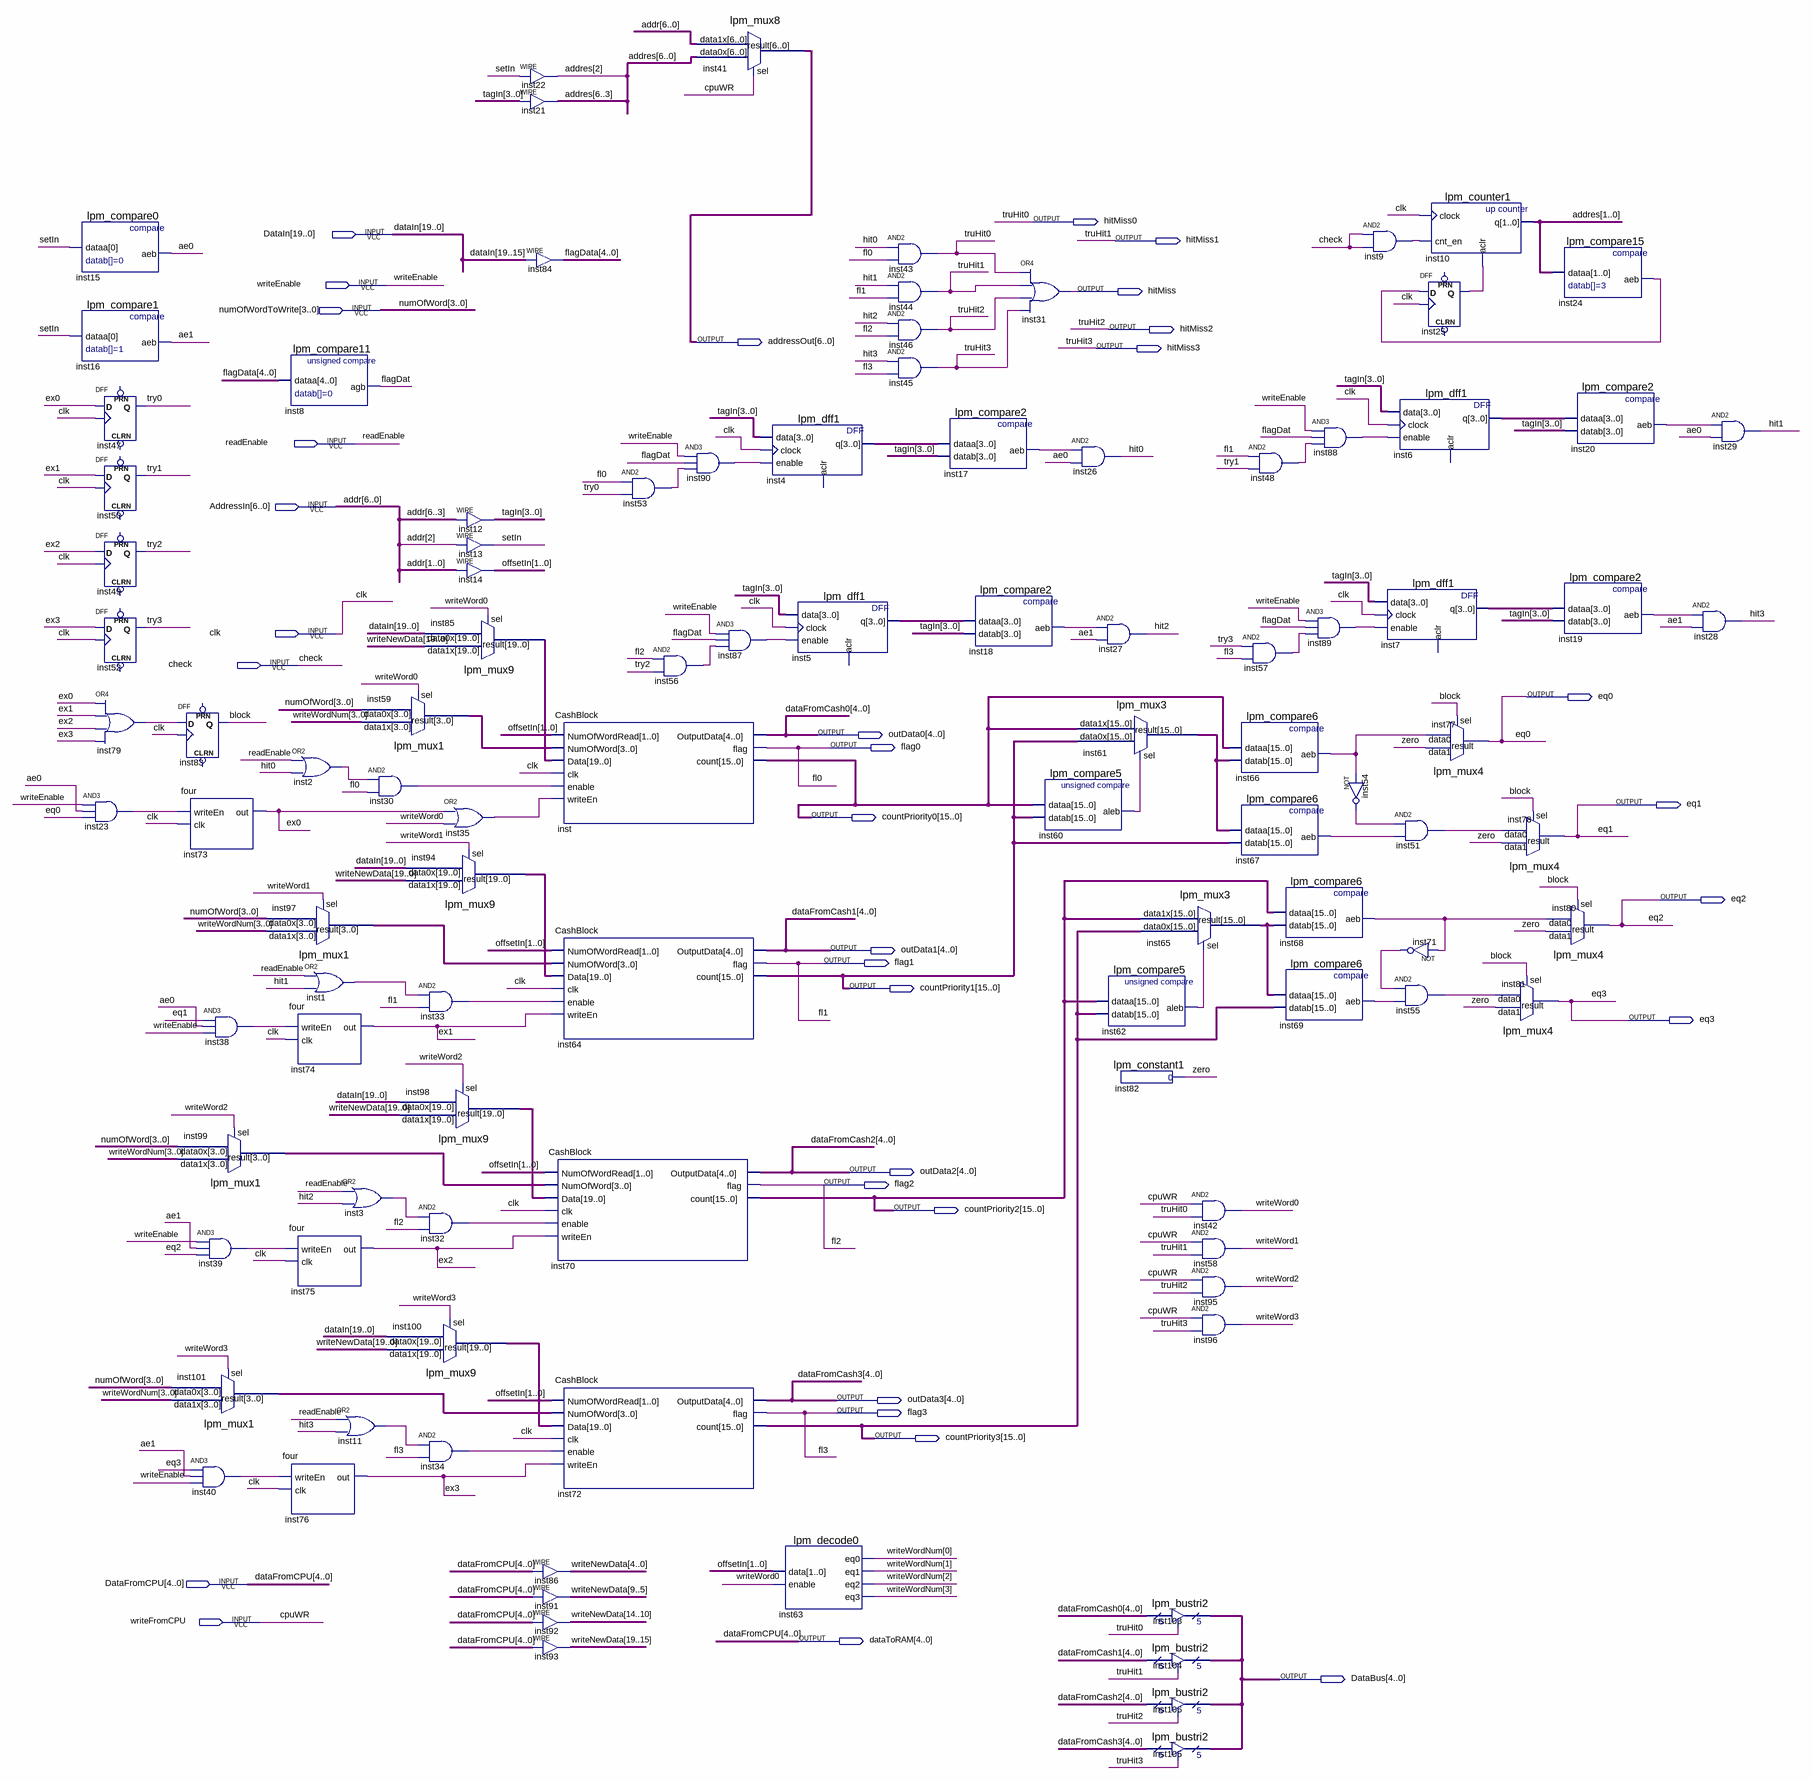
[diagram p0: schematic sheet]
// Quartus schematic Cash.bdf as structural Verilog: 104 symbols, 33 pins
module Cash (
  input  [19:0] DataIn,
  input  writeEnable,
  input  [3:0] numOfWordToWrite,
  input  readEnable,
  input  [6:0] AddressIn,
  input  clk,
  input  check,
  input  [4:0] DataFromCPU,
  input  writeFromCPU,
  output hitMiss0,
  output hitMiss1,
  output hitMiss,
  output hitMiss2,
  output [6:0] addressOut,
  output hitMiss3,
  output eq0,
  output [4:0] outData0,
  output flag0,
  output eq1,
  output [15:0] countPriority0,
  output eq2,
  output [4:0] outData1,
  output flag1,
  output [15:0] countPriority1,
  output eq3,
  output [4:0] outData2,
  output flag2,
  output [15:0] countPriority2,
  output [4:0] outData3,
  output flag3,
  output [15:0] countPriority3,
  output [4:0] dataToRAM,
  output [4:0] DataBus
);

  wire ae0, ae1, block, ex0, ex1, ex2, ex3, flagDat, hit0, hit1, hit2, hit3, inst1_out, inst2_out, inst3_out,
       inst9_out, inst11_out, inst17_aeb, inst18_aeb, inst19_aeb, inst20_aeb, inst23_out, inst24_aeb,
       inst25_q, inst30_out, inst32_out, inst33_out, inst34_out, inst35_out, inst38_out, inst39_out,
       inst40_out, inst48_out, inst51_out, inst53_out, inst54_out, inst55_out, inst56_out, inst57_out,
       inst60_aleb, inst62_aleb, inst66_aeb, inst67_aeb, inst68_aeb, inst69_aeb, inst71_out, inst79_out,
       inst87_out, inst88_out, inst89_out, inst90_out, setIn, try0, try1, try2, try3, writeWord0, writeWord1,
       writeWord2, writeWord3, zero;
  wire [1:0] offsetIn;
  wire [3:0] inst4_q, inst5_q, inst6_q, inst7_q, inst59_result, inst97_result, inst99_result, inst101_result,
       tagIn, writeWordNum;
  wire [4:0] flagData;
  wire [6:0] addres;
  wire [15:0] inst61_result, inst65_result;
  wire [19:0] inst85_result, inst94_result, inst98_result, inst100_result, writeNewData;

  lpm_compare0 inst15 (.dataa(setIn), .aeb(ae0));
  lpm_compare1 inst16 (.dataa(setIn), .aeb(ae1));
  DFF inst47 (.CLK(clk), .D(ex0), .Q(try0));  // open: CLRN, PRN
  DFF inst50 (.CLK(clk), .D(ex1), .Q(try1));  // open: CLRN, PRN
  DFF inst49 (.CLK(clk), .D(ex2), .Q(try2));  // open: CLRN, PRN
  DFF inst52 (.CLK(clk), .D(ex3), .Q(try3));  // open: CLRN, PRN
  or inst79 (inst79_out, ex0, ex1, ex2, ex3);
  and inst23 (inst23_out, writeEnable, ae0, eq0);
  DFF inst83 (.CLK(clk), .D(inst79_out), .Q(block));  // open: CLRN, PRN
  four inst73 (.writeEn(inst23_out), .clk(clk), .out(ex0));
  and inst38 (inst38_out, eq1, ae0, writeEnable);
  lpm_mux1 inst99 (.data1x(writeWordNum), .data0x(numOfWordToWrite), .sel(writeWord2), .result(inst99_result));
  and inst39 (inst39_out, writeEnable, ae1, eq2);
  lpm_mux1 inst101 (.data1x(writeWordNum), .data0x(numOfWordToWrite), .sel(writeWord3), .result(inst101_result));
  and inst40 (inst40_out, eq3, ae1, writeEnable);
  lpm_mux1 inst97 (.data1x(writeWordNum), .data0x(numOfWordToWrite), .sel(writeWord1), .result(inst97_result));
  lpm_compare11 inst8 (.dataa(flagData), .agb(flagDat));
  or inst2 (inst2_out, readEnable, hit0);
  or inst1 (inst1_out, readEnable, hit1);
  four inst74 (.writeEn(inst38_out), .clk(clk), .out(ex1));
  four inst75 (.writeEn(inst39_out), .clk(clk), .out(ex2));
  four inst76 (.writeEn(inst40_out), .clk(clk), .out(ex3));
  lpm_mux1 inst59 (.data1x(writeWordNum), .data0x(numOfWordToWrite), .sel(writeWord0), .result(inst59_result));
  and inst30 (inst30_out, inst2_out, flag0);
  or inst3 (inst3_out, readEnable, hit2);
  or inst11 (inst11_out, readEnable, hit3);
  lpm_mux9 inst94 (.data1x(writeNewData), .data0x(DataIn), .sel(writeWord1), .result(inst94_result));
  and inst33 (inst33_out, inst1_out, flag1);
  lpm_mux9 inst98 (.data1x(writeNewData), .data0x(DataIn), .sel(writeWord2), .result(inst98_result));
  and inst32 (inst32_out, inst3_out, flag2);
  lpm_mux9 inst100 (.data1x(writeNewData), .data0x(DataIn), .sel(writeWord3), .result(inst100_result));
  and inst34 (inst34_out, inst11_out, flag3);
  assign tagIn = AddressIn[6:3];  // WIRE inst12
  assign setIn = AddressIn[2];  // WIRE inst13
  assign offsetIn = AddressIn[1:0];  // WIRE inst14
  lpm_mux9 inst85 (.data1x(writeNewData), .data0x(DataIn), .sel(writeWord0), .result(inst85_result));
  or inst35 (inst35_out, ex0, writeWord0);
  assign addres[2] = setIn;  // WIRE inst22
  assign addres[6:3] = tagIn;  // WIRE inst21
  assign flagData = DataIn[19:15];  // WIRE inst84
  CashBlock inst (
    .NumOfWordRead(offsetIn), .NumOfWord(inst59_result), .Data(inst85_result), .clk(clk),
    .enable(inst30_out), .writeEn(inst35_out), .OutputData(outData0), .flag(flag0), .count(countPriority0));
  CashBlock inst64 (
    .NumOfWordRead(offsetIn), .NumOfWord(inst97_result), .Data(inst94_result), .clk(clk),
    .enable(inst33_out), .writeEn(ex1), .OutputData(outData1), .flag(flag1), .count(countPriority1));
  CashBlock inst70 (
    .NumOfWordRead(offsetIn), .NumOfWord(inst99_result), .Data(inst98_result), .clk(clk),
    .enable(inst32_out), .writeEn(ex2), .OutputData(outData2), .flag(flag2), .count(countPriority2));
  CashBlock inst72 (
    .NumOfWordRead(offsetIn), .NumOfWord(inst101_result), .Data(inst100_result), .clk(clk),
    .enable(inst34_out), .writeEn(ex3), .OutputData(outData3), .flag(flag3), .count(countPriority3));
  assign writeNewData[4:0] = DataFromCPU;  // WIRE inst86
  assign writeNewData[9:5] = DataFromCPU;  // WIRE inst91
  assign writeNewData[14:10] = DataFromCPU;  // WIRE inst92
  assign writeNewData[19:15] = DataFromCPU;  // WIRE inst93
  and inst53 (inst53_out, flag0, try0);
  and inst56 (inst56_out, flag2, try2);
  lpm_mux8 inst41 (.data1x(AddressIn), .data0x(addres), .sel(writeFromCPU), .result(addressOut));
  and inst90 (inst90_out, writeEnable, flagDat, inst53_out);
  and inst87 (inst87_out, writeEnable, flagDat, inst56_out);
  lpm_dff1 inst4 (.data(tagIn), .clock(clk), .enable(inst90_out), .q(inst4_q));  // open: aclr
  lpm_decode0 inst63 (
    .data(offsetIn), .enable(writeWord0), .eq0(writeWordNum[0]), .eq1(writeWordNum[1]),
    .eq2(writeWordNum[2]), .eq3(writeWordNum[3]));
  lpm_dff1 inst5 (.data(tagIn), .clock(clk), .enable(inst87_out), .q(inst5_q));  // open: aclr
  and inst43 (hitMiss0, hit0, flag0);
  and inst44 (hitMiss1, hit1, flag1);
  and inst46 (hitMiss2, hit2, flag2);
  and inst45 (hitMiss3, hit3, flag3);
  lpm_compare2 inst17 (.dataa(inst4_q), .datab(tagIn), .aeb(inst17_aeb));
  lpm_compare2 inst18 (.dataa(inst5_q), .datab(tagIn), .aeb(inst18_aeb));
  or inst31 (hitMiss, hitMiss0, hitMiss1, hitMiss2, hitMiss3);
  and inst26 (hit0, inst17_aeb, ae0);
  lpm_mux3 inst61 (.data1x(countPriority0), .data0x(countPriority1), .sel(inst60_aleb), .result(inst61_result));
  lpm_compare5 inst60 (.dataa(countPriority0), .datab(countPriority1), .aleb(inst60_aleb));
  and inst27 (hit2, inst18_aeb, ae1);
  lpm_compare5 inst62 (.dataa(countPriority2), .datab(countPriority3), .aleb(inst62_aleb));
  lpm_constant1 inst82 (.result(zero));
  lpm_mux3 inst65 (.data1x(countPriority2), .data0x(countPriority3), .sel(inst62_aleb), .result(inst65_result));
  lpm_bustri2 inst103 (.enabledt(hitMiss0), .data(outData0), .tridata(DataBus));
  lpm_bustri2 inst104 (.enabledt(hitMiss1), .data(outData1), .tridata(DataBus));
  lpm_bustri2 inst106 (.enabledt(hitMiss2), .data(outData2), .tridata(DataBus));
  lpm_bustri2 inst105 (.enabledt(hitMiss3), .data(outData3), .tridata(DataBus));
  lpm_compare6 inst66 (.dataa(countPriority0), .datab(inst61_result), .aeb(inst66_aeb));
  lpm_compare6 inst67 (.dataa(inst61_result), .datab(countPriority1), .aeb(inst67_aeb));
  and inst42 (writeWord0, writeFromCPU, hitMiss0);
  and inst58 (writeWord1, writeFromCPU, hitMiss1);
  and inst95 (writeWord2, writeFromCPU, hitMiss2);
  and inst96 (writeWord3, writeFromCPU, hitMiss3);
  and inst48 (inst48_out, flag1, try1);
  and inst57 (inst57_out, try3, flag3);
  lpm_compare6 inst68 (.dataa(countPriority2), .datab(inst65_result), .aeb(inst68_aeb));
  lpm_compare6 inst69 (.dataa(inst65_result), .datab(countPriority3), .aeb(inst69_aeb));
  and inst88 (inst88_out, writeEnable, flagDat, inst48_out);
  and inst89 (inst89_out, writeEnable, flagDat, inst57_out);
  and inst9 (inst9_out, check, check);
  lpm_dff1 inst7 (.data(tagIn), .clock(clk), .enable(inst89_out), .q(inst7_q));  // open: aclr
  not inst54 (inst54_out, inst66_aeb);
  lpm_counter1 inst10 (.clock(clk), .cnt_en(inst9_out), .aclr(inst25_q), .q(addres[1:0]));
  DFF inst25 (.CLK(clk), .D(inst24_aeb), .Q(inst25_q));  // open: CLRN, PRN
  lpm_dff1 inst6 (.data(tagIn), .clock(clk), .enable(inst88_out), .q(inst6_q));  // open: aclr
  lpm_mux4 inst77 (.data1(zero), .data0(inst66_aeb), .sel(block), .result(eq0));
  and inst51 (inst51_out, inst54_out, inst67_aeb);
  not inst71 (inst71_out, inst68_aeb);
  and inst55 (inst55_out, inst71_out, inst69_aeb);
  lpm_mux4 inst78 (.data1(zero), .data0(inst51_out), .sel(block), .result(eq1));
  lpm_mux4 inst81 (.data1(zero), .data0(inst55_out), .sel(block), .result(eq3));
  lpm_compare15 inst24 (.dataa(addres[1:0]), .aeb(inst24_aeb));
  lpm_compare2 inst20 (.dataa(inst6_q), .datab(tagIn), .aeb(inst20_aeb));
  lpm_compare2 inst19 (.dataa(inst7_q), .datab(tagIn), .aeb(inst19_aeb));
  lpm_mux4 inst80 (.data1(zero), .data0(inst68_aeb), .sel(block), .result(eq2));
  and inst29 (hit1, inst20_aeb, ae0);
  and inst28 (hit3, inst19_aeb, ae1);

  assign dataToRAM = DataFromCPU;

  // Other names for the same wires on the sheet: addr[6:0] = AddressIn; cpuWR = writeFromCPU;
  //   dataFromCash0[4:0] = outData0; dataFromCash2[4:0] = outData2; dataFromCash3[4:0] = outData3; fl0 = flag0;
  //   fl1 = flag1; fl3 = flag3; fl2 = flag2; numOfWord[3:0] = numOfWordToWrite; dataFromCash1[4:0] = outData1;
  //   truHit0 = hitMiss0; truHit1 = hitMiss1; truHit2 = hitMiss2; truHit3 = hitMiss3
endmodule
